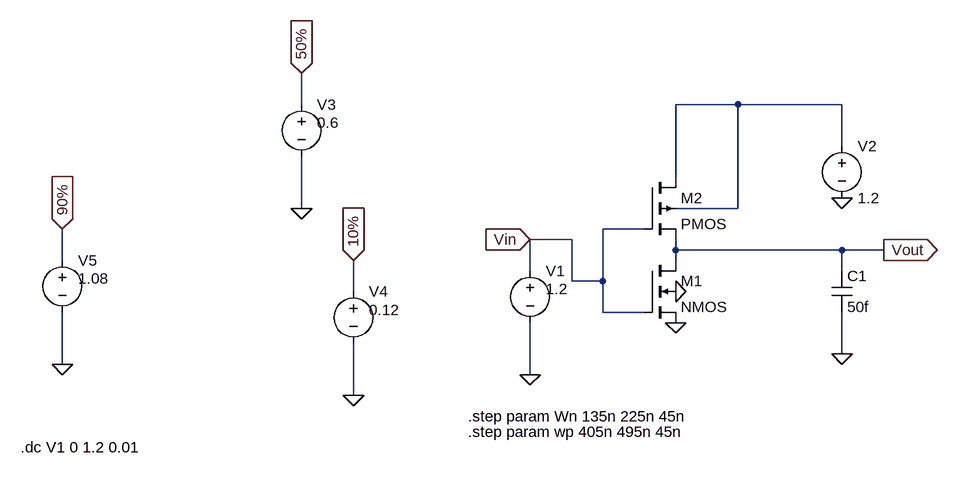
[diagram p0: schematic 90_parm_change_inverter - VTC.asc]
90_parm_change_inverter - VTC.asc, the LTspice schematic file:
Version 4.1
SHEET 1 1112 680
WIRE -64 -32 -64 -80
WIRE 608 -32 512 -32
WIRE 768 -32 608 -32
WIRE 768 32 768 -32
WIRE 512 80 512 -32
WIRE -64 128 -64 48
WIRE 608 128 608 -32
WIRE 608 128 512 128
WIRE 464 160 400 160
WIRE 352 176 288 176
WIRE 512 192 512 176
WIRE 768 192 512 192
WIRE 832 192 768 192
WIRE -432 208 -432 160
WIRE 512 208 512 192
WIRE 288 224 288 176
WIRE 768 224 768 192
WIRE 352 240 352 176
WIRE 400 240 400 160
WIRE 400 240 352 240
WIRE 16 256 16 208
WIRE 400 288 400 240
WIRE 464 288 400 288
WIRE 768 352 768 288
WIRE -432 368 -432 288
WIRE 288 384 288 304
WIRE 16 416 16 336
FLAG 288 384 0
FLAG 768 112 0
FLAG 512 304 0
FLAG 512 256 0
FLAG 768 352 0
FLAG 288 176 Vin
IOPIN 288 176 In
FLAG 832 192 Vout
IOPIN 832 192 Out
FLAG -64 128 0
FLAG -64 -80 50%
IOPIN -64 -80 In
FLAG 16 416 0
FLAG 16 208 10%
IOPIN 16 208 In
FLAG -432 368 0
FLAG -432 160 90%
IOPIN -432 160 In
SYMBOL nmos4 464 208 R0
SYMATTR InstName M1
SYMATTR Value2 l=90nm w=Wn
SYMBOL pmos4 464 80 R0
SYMATTR InstName M2
SYMATTR Value2 l=90nm w=Wp
SYMBOL cap 752 224 R0
SYMATTR InstName C1
SYMATTR Value 50f
SYMBOL voltage 288 208 R0
WINDOW 123 0 0 Left 0
WINDOW 39 0 0 Left 0
WINDOW 3 24 44 Left 2
SYMATTR Value 1.2
SYMATTR InstName V1
SYMBOL voltage 768 16 R0
WINDOW 123 0 0 Left 0
WINDOW 39 0 0 Left 0
SYMATTR InstName V2
SYMATTR Value 1.2
SYMBOL voltage -64 -48 R0
WINDOW 123 0 0 Left 0
WINDOW 39 0 0 Left 0
WINDOW 3 24 44 Left 2
SYMATTR Value 0.6
SYMATTR InstName V3
SYMBOL voltage 16 240 R0
WINDOW 123 0 0 Left 0
WINDOW 39 0 0 Left 0
WINDOW 3 24 44 Left 2
SYMATTR Value 0.12
SYMATTR InstName V4
SYMBOL voltage -432 192 R0
WINDOW 123 0 0 Left 0
WINDOW 39 0 0 Left 0
WINDOW 3 24 44 Left 2
SYMATTR Value 1.08
SYMATTR InstName V5
TEXT 192 448 Left 2 !.step param Wn 135n 225n 45n
TEXT 192 472 Left 2 !.step param wp 405n 495n 45n
TEXT -496 496 Left 2 !.dc V1 0 1.2 0.01

The netlist it stands for:
* 90_parm_change_inverter - VTC.asc
M1 Vout Vin 0 0 NMOS l=90nm w=Wn
M2 N001 Vin Vout N001 PMOS l=90nm w=Wp
C1 Vout 0 50f
V1 Vin 0 1.2
V2 N001 0 1.2
V3 50% 0 0.6
V4 10% 0 0.12
V5 90% 0 1.08
.model NMOS NMOS
.model PMOS PMOS
.lib standard.mos
.step param Wn 135n 225n 45n
.step param wp 405n 495n 45n
.dc V1 0 1.2 0.01
.backanno
.end